# EAGLE design PoE (EAGLE 4.16)
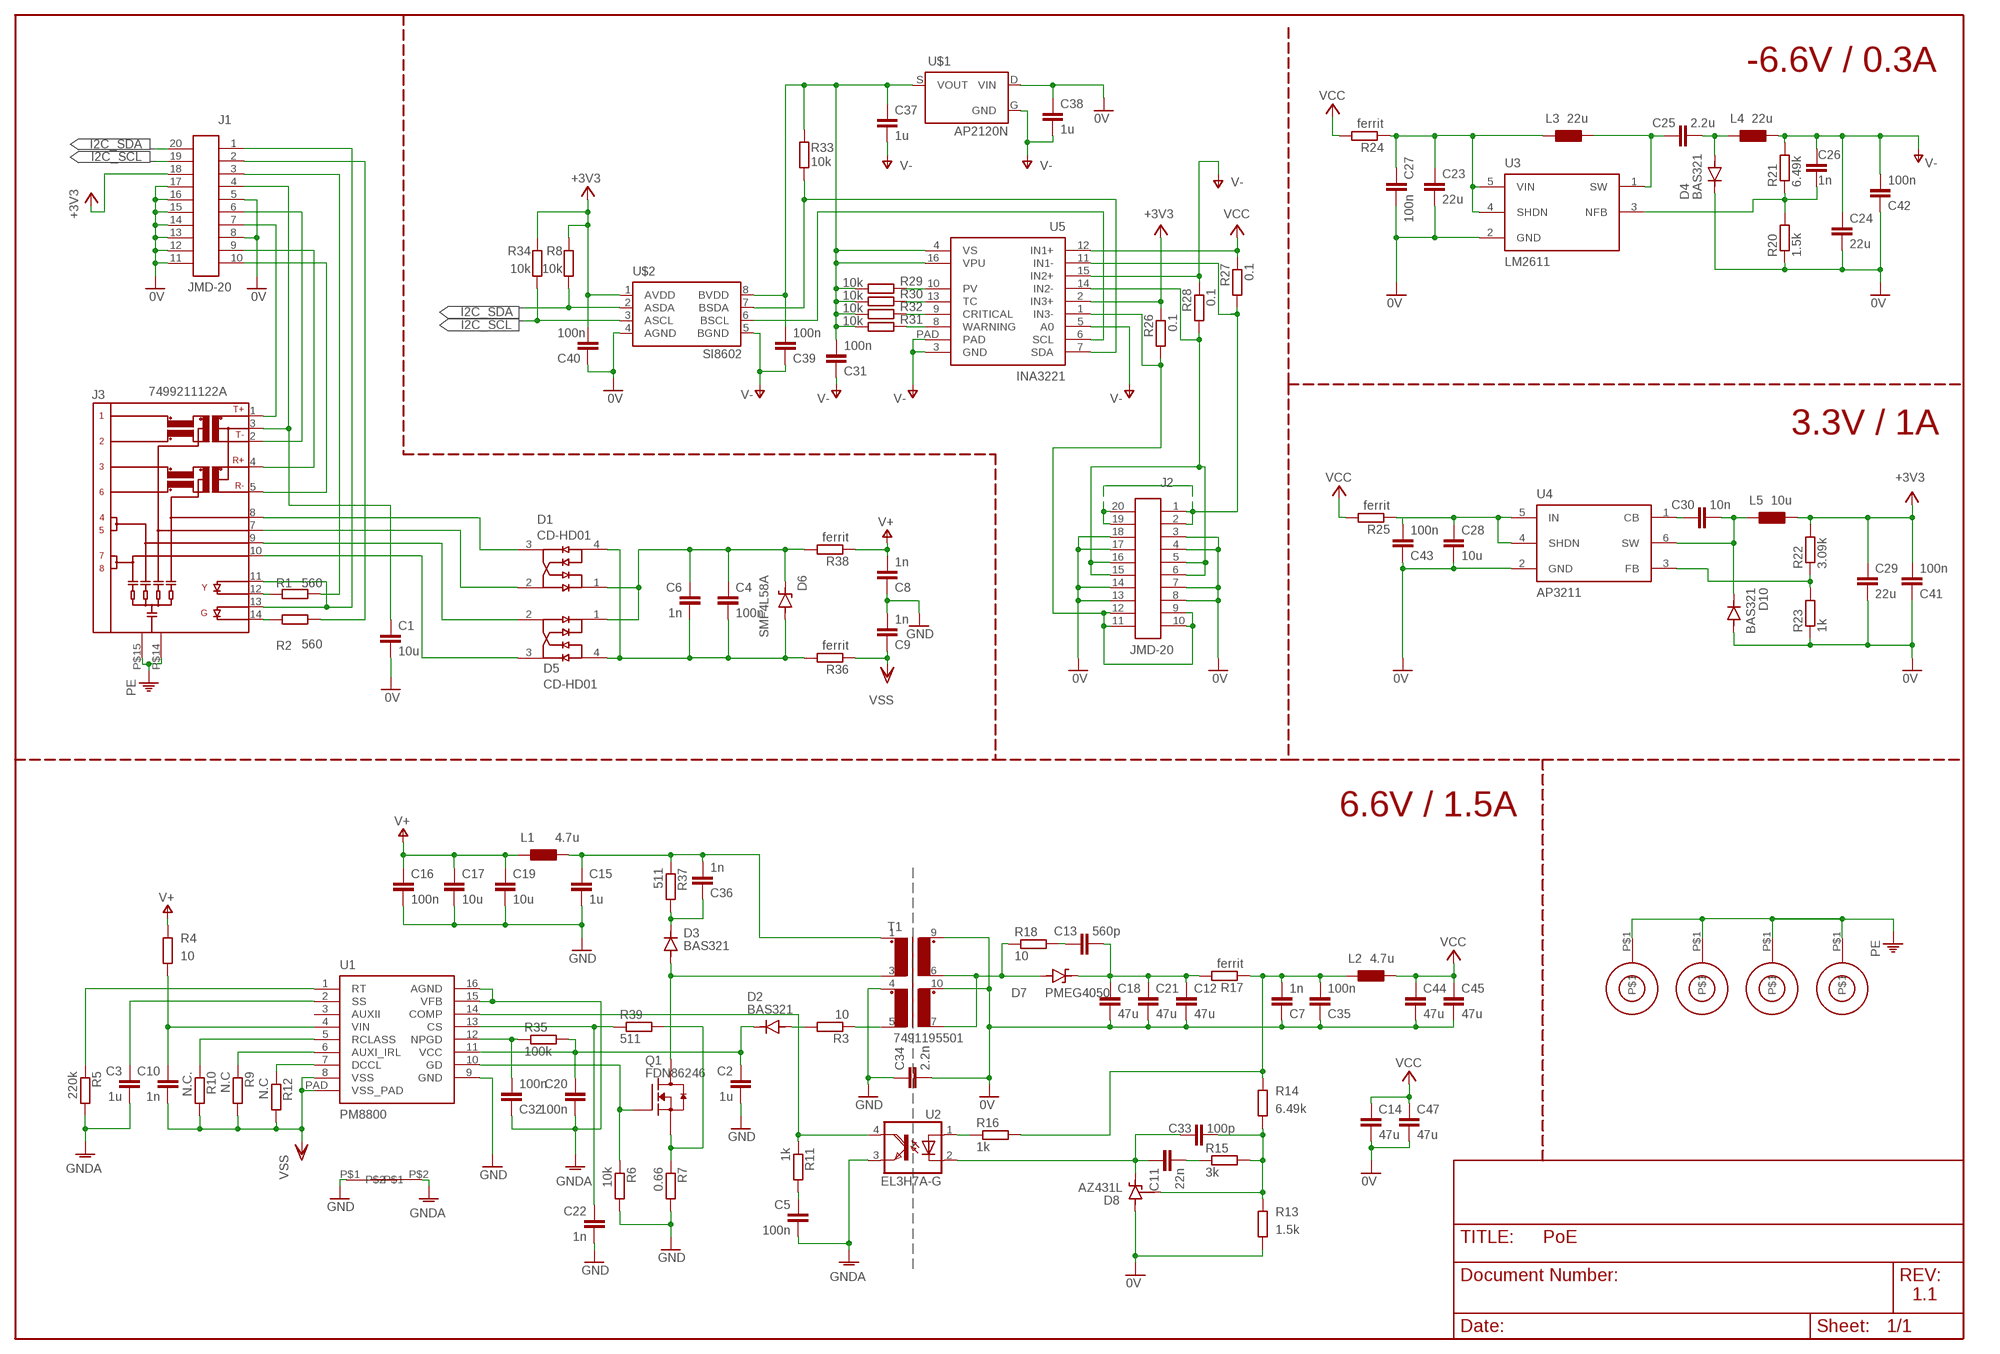
[diagram p0: schematic, sheet 1]

## Parts
C1  10u  C-EUC0603K  [C0603K]
C2  1u  C-EUC0603K  [C0603K]
C3  1u  C-EUC0603K  [C0603K]
C4  100n  C-EUC1206  [C1206]
C5  100n  C-EUC0603K  [C0603K]
C6  1n  C-EUC0603K  [C0603K]
C7  1n  C-EUC0603K  [C0603K]
C8  1n  C-EUC0603K  [C0603K]
C9  1n  C-EUC0603K  [C0603K]
C10  1n  C-EUC0603K  [C0603K]
C11  22n  C-EUC0603K  [C0603K]
C12  47u  C-EUC1206  [C1206]
C13  560p  C-EUC0603K  [C0603K]
C14  47u  C-EUC1206  [C1206]
C15  1u  C-EUC1206  [C1206]
C16  100n  C-EUC1206  [C1206]
C17  10u  C-EUC2220K  [C2220K]
C18  47u  C-EUC1206  [C1206]
C19  10u  C-EUC2220K  [C2220K]
C20  100n  C-EUC0603K  [C0603K]
C21  47u  C-EUC1206  [C1206]
C22  1n  C-EUC0603K  [C0603K]
C23  22u  C-EUC1206  [C1206]
C24  22u  C-EUC1206  [C1206]
C25  2.2u  C-EUC0603K  [C0603K]
C26  1n  C-EUC0603K  [C0603K]
C27  100n  C-EUC0603K  [C0603K]
C28  10u  C-EUC1206  [C1206]
C29  22u  C-EUC1206  [C1206]
C30  10n  C-EUC0603K  [C0603K]
C31  100n  C-EUC0603K  [C0603K]
C32  100n  C-EUC0603K  [C0603K]
C33  100p  C-EUC0603K  [C0603K]
C34  2.2n  C-EUC1206  [C1206]
C35  100n  C-EUC0603K  [C0603K]
C36  1n  C-EUC0603K  [C0603K]
C37  1u  C-EUC0603K  [C0603K]
C38  1u  C-EUC0603K  [C0603K]
C39  100n  C-EUC0603K  [C0603K]
C40  100n  C-EUC0603K  [C0603K]
C41  100n  C-EUC0603K  [C0603K]
C42  100n  C-EUC0603K  [C0603K]
C43  100n  C-EUC0603K  [C0603K]
C44  47u  C-EUC1206  [C1206]
C45  47u  C-EUC1206  [C1206]
C47  47u  C-EUC1206  [C1206]
D1  CD-HD01  [RECT]
D2  BAS321  [SOD323_R]
D3  BAS321  [SOD323_R]
D4  BAS321  [SOD323_R]
D5  CD-HD01  [RECT]
D6  SMF4L58A  [SOD123FL]
D7  PMEG4050  [SOD128]
D8  AZ431L  [SSOT-3]
D10  BAS321  [SOD323_R]
J1  JMD-20  [CON]
J2  JMD-20  [CON]
J3  7499211122A  [ETH2]
L1  4.7u  VLS252010HBX  [2520]
L2  4.7u  VLS252010HBX  [2520]
L3  22u  VLS252010HBX  [2520]
L4  22u  VLS252010HBX  [2520]
L5  10u  VLS252010HBX  [2520]
Q1  FDN86246  [SSOT-3]
R1  560  R-EU_R0603  [R0603]
R2  560  R-EU_R0603  [R0603]
R3  10  R-EU_R0603  [R0603]
R4  10  R-EU_R0603  [R0603]
R5  220k  R-EU_R0603  [R0603]
R6  10k  R-EU_R0603  [R0603]
R7  0.66  R-EU_R0603  [R0603]
R8  10k  R-EU_R0603  [R0603]
R9  N.C  R-EU_R0603  [R0603]
R10  N.C.  R-EU_R0603  [R0603]
R11  1k  R-EU_R0603  [R0603]
R12  N.C  R-EU_R0603  [R0603]
R13  1.5k  R-EU_R0603  [R0603]
R14  6.49k  R-EU_R0603  [R0603]
R15  3k  R-EU_R0603  [R0603]
R16  1k  R-EU_R0603  [R0603]
R17  ferrit  R-EU_R0603  [R0603]
R18  10  R-EU_R0603  [R0603]
R19  EMPTY  [EMPTY]
R20  1.5k  R-EU_R0603  [R0603]
R21  6.49k  R-EU_R0603  [R0603]
R22  3.09k  R-EU_R0603  [R0603]
R23  1k  R-EU_R0603  [R0603]
R24  ferrit  R-EU_R0603  [R0603]
R25  ferrit  R-EU_R0603  [R0603]
R26  0.1  R-EU_R0603  [R0603]
R27  0.1  R-EU_R0603  [R0603]
R28  0.1  R-EU_R0603  [R0603]
R29  10k  R-EU_R0603  [R0603]
R30  10k  R-EU_R0603  [R0603]
R31  10k  R-EU_R0603  [R0603]
R32  10k  R-EU_R0603  [R0603]
R33  10k  R-EU_R0603  [R0603]
R34  10k  R-EU_R0603  [R0603]
R35  100k  R-EU_R0603  [R0603]
R36  ferrit  R-EU_R0603  [R0603]
R37  511  R-EU_R0603  [R0603]
R38  ferrit  R-EU_R0603  [R0603]
R39  511  R-EU_R0603  [R0603]
T1  7491195501  [POE]
U1  PM8800  [PM8800]
U2  EL3H7A-G  [OPTO]
U3  LM2611  [SOT-23-5]
U4  AP3211  [SOT-23-6]
U5  INA3221  [INA3221]
U$1  AP2120N  [SSOT-3]
U$2  SI8602  [SO8]
U$3  MOUNT  [MOUNT]
U$4  MOUNT  [MOUNT]
U$7  MOUNT  [MOUNT]
U$11  MOUNT  [MOUNT]

## Nets
0V: C1.2 C7.1 C12.2 C14.2 C18.2 C21.2 C23.2 C24.2 C27.2 C28.2 C29.2 C34.2 C35.1 C38.1 C40.1 C41.1 C42.1 C43.1 C44.2 C45.2 C47.2 D4.C(K) D8.D(A) D10.A J1.5 J1.8 J1.11 J1.12 J1.13 J1.14 J1.15 J1.16 J1.17 J2.3 J2.4 J2.7 J2.8 J2.13 J2.14 J2.17 J2.18 R13.1 R20.1 R23.1 T1.9 T1.10 U3.2(GND) U4.2(GND) U$1.D(VIN) U$2.4(AGND)
+3V3: C29.1 C40.2 C41.2 J1.18 L5.P$2 R8.2 R22.2 R26.1 R34.2 U5.2(IN3+) U$2.1(AVDD)
GND: C2.2 C8.1 C9.2 C15.2 C16.2 C17.2 C19.2 C22.2 C34.1 R6.2 R7.2 R19.P$1 T1.4 U1.9(GND)
GNDA: C3.2 C5.2 C20.2 C32.1 R5.2 R19.P$2 U1.15(VFB) U1.16(AGND) U2.3
I2C_SCL: J1.19 R34.1 U$2.3(ASCL)
I2C_SCL2: U5.6(SCL) U$2.6(BSCL)
I2C_SDA: J1.20 R8.1 U$2.2(ASDA)
I2C_SDA2: R33.2 U5.7(SDA) U$2.7(BSDA)
N$1: D7.2 R18.1 T1.6 T1.7
N$2: C11.1 C33.1 D8.S(K) U2.2
N$3: C13.1 R18.2
N$4: J1.6 J3.2
N$5: J1.9 J3.4
N$6: J1.10 J3.5
N$7: D1.3 J3.8
N$8: D1.2 J3.7
N$9: J1.1 J3.11 J3.13
N$10: D5.3 J3.10
N$11: D5.2 J3.9
N$12: J1.3 R1.2
N$13: J1.2 R2.2
N$14: J3.14 R2.1
N$15: J3.12 R1.1
N$16: C3.1 U1.2(SS)
N$17: C1.1 J1.4 J3.3
N$18: C2.1 C20.1 D2.C(K) R35.2 U1.11(VCC)
N$19: D2.A R3.2
N$20: R3.1 T1.5
N$21: C10.1 R4.2 U1.4(VIN)
N$22: R5.1 U1.1(RT)
N$23: D3.A Q1.D T1.3
N$24: Q1.G R6.1 U1.10(GD)
N$25: Q1.S R7.1 R39.2
N$26: C4.2 C6.2 D1.4 D5.4 D6.2 R36.2
N$27: R9.1 U1.6(AUXI_IRL)
N$28: C31.2 C37.1 C39.2 R29.1 R30.1 R31.1 R32.1 R33.1 U5.4(VS) U5.16(VPU) U$1.S(VOUT) U$2.8(BVDD)
N$29: R10.1 U1.5(RCLASS)
N$30: R12.1 U1.7(DCCL)
N$31: R11.1 U1.14(COMP) U2.4
N$32: J1.7 J3.1
N$33: C5.1 R11.2
N$34: C36.1 D3.C(K) R37.2
N$35: R16.1 U2.1
N$36: C11.2 R15.1
N$37: C33.2 D8.G(R) R13.2 R14.2 R15.2
N$38: C15.1 C36.2 L1.P$2 R37.1 T1.1
N$39: C7.2 C35.2 L2.P$1 R14.1 R16.2 R17.1
N$43: C22.1 R39.1 U1.13(CS)
N$47: C23.1 C27.1 L3.P$1 R24.1 U3.4(SHDN) U3.5(VIN)
N$48: C28.1 C43.2 R25.1 U4.4(SHDN) U4.5(IN)
N$49: C32.2 R35.1 U1.12(NPGD)
N$50: C25.1 L3.P$2 U3.1(SW)
N$51: C25.2 D4.A L4.P$1
N$53: C30.1 U4.1(CB)
N$54: C26.2 R20.2 R21.1 U3.3(NFB)
N$55: C30.2 D10.C(K) L5.P$1 U4.6(SW)
N$56: R22.1 R23.2 U4.3(FB)
N$57: J2.9 J2.10 J2.11 J2.12 R26.2 U5.1(IN3-)
N$59: R29.2 U5.10(PV)
N$60: J2.5 J2.6 J2.15 J2.16 R28.2 U5.14(IN2-)
N$61: R30.2 U5.13(TC)
N$62: R32.2 U5.9(CRITICAL)
N$63: R31.2 U5.8(WARNING)
N$68: C12.1 C13.2 C18.1 C21.1 D7.1 R17.2
N$69: C4.1 C6.1 D1.1 D5.1 D6.1 R38.2
N$70: J2.1 J2.2 J2.19 J2.20 R27.2 U5.11(IN1-)
PE: J3.P$14 J3.P$15 U$3.P$1 U$4.P$1 U$7.P$1 U$11.P$1
V+: C8.2 C16.1 C17.1 C19.1 L1.P$1 R4.1 R38.1
V-: C24.1 C26.1 C31.1 C37.2 C38.2 C39.1 C42.2 L4.P$2 R21.2 R28.1 U5.3(GND) U5.5(A0) U5.15(IN2+) U5.PAD U$1.G(GND) U$2.5(BGND)
VCC: C14.1 C44.1 C45.1 C47.1 L2.P$2 R24.2 R25.2 R27.1 U5.12(IN1+)
VSS: C9.1 C10.2 R9.2 R10.2 R12.2 R36.1 U1.8(VSS) U1.PAD(VSS_PAD)
Unconnected: U1.3(AUXII)

## Notes on the sheet
- -6.6V / 0.3A
- 3.3V / 1A
- 6.6V / 1.5A
- 1.1

## Library data of the parts
C1-C45 C47 = rcl:C-EU: CAPACITOR, European symbol
D1 D5 = trafo_mod:CD-HD01
D2-D4 D10 = trafo_mod:BAS321
D6 = trafo_mod:SMF4L58A
D7 = trafo_mod:PMEG4050
D8 = trafo_mod:AZ431L
J1 J2 = trafo_mod:JMD-20
J3 = trafo_mod:7499211122A
L1-L5 = trafo_mod:VLS252010HBX
Q1 = trafo_mod:FDN86246
R1-R18 R20-R39 = rcl:R-EU_: RESISTOR, European symbol
R19 = trafo_mod:EMPTY
T1 = trafo_mod:7491195501
U1 = trafo_mod:PM8800
U2 = trafo_mod:EL3H7A-G
U3 = trafo_mod:LM2611
U4 = trafo_mod:AP3211
U5 = trafo_mod:INA3221
U$1 = trafo_mod:AP2120N
U$2 = trafo_mod:SI8602
U$3 U$4 U$7 U$11 = trafo_mod:MOUNT

## Board
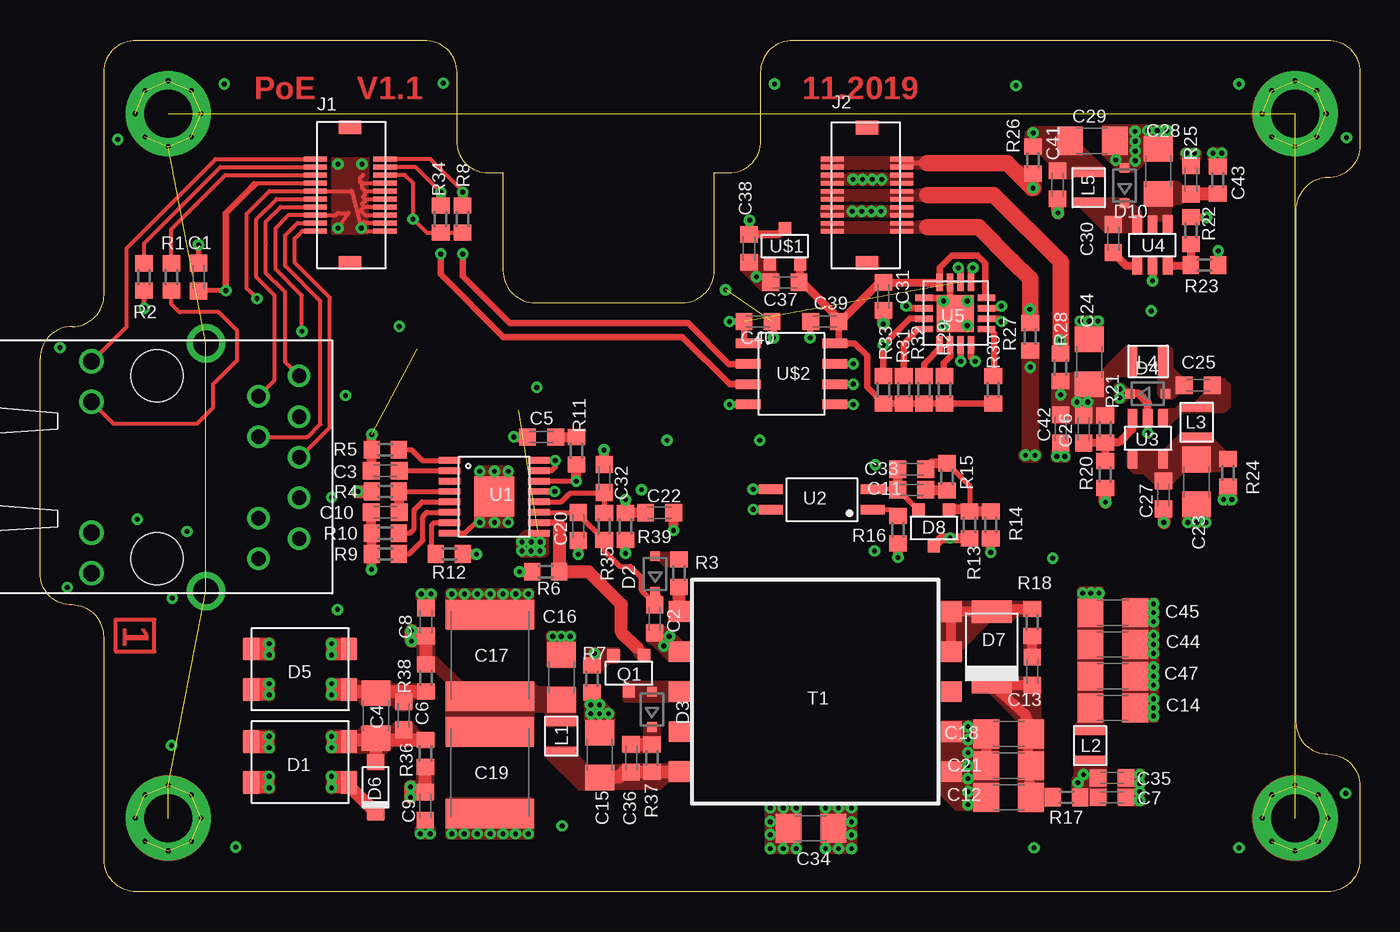
[diagram p1: board, top side]
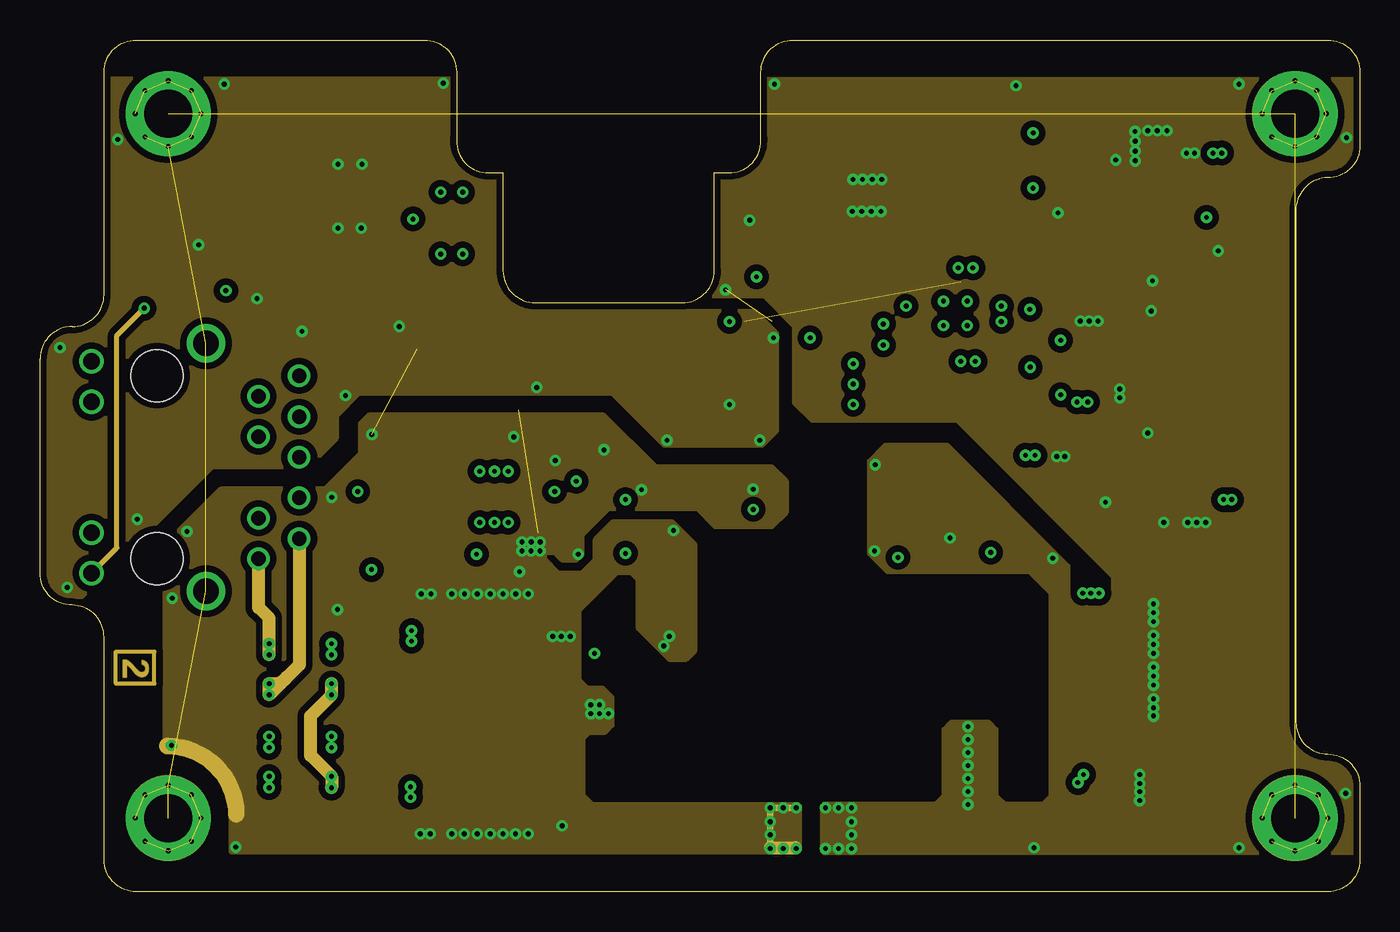
[diagram p2: board, inner layer Route2]
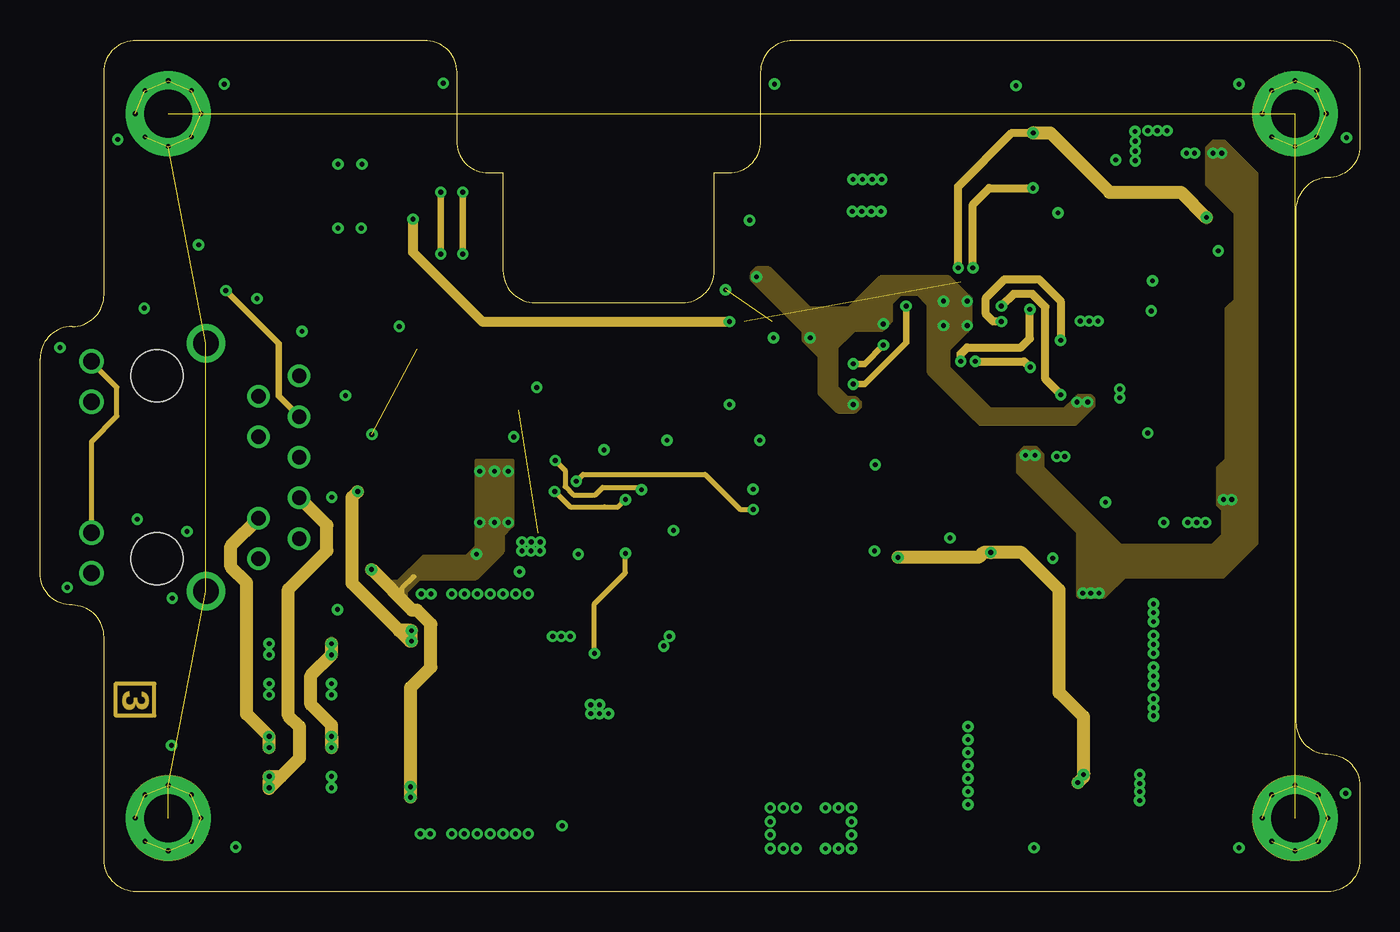
[diagram p3: board, inner layer Route15]
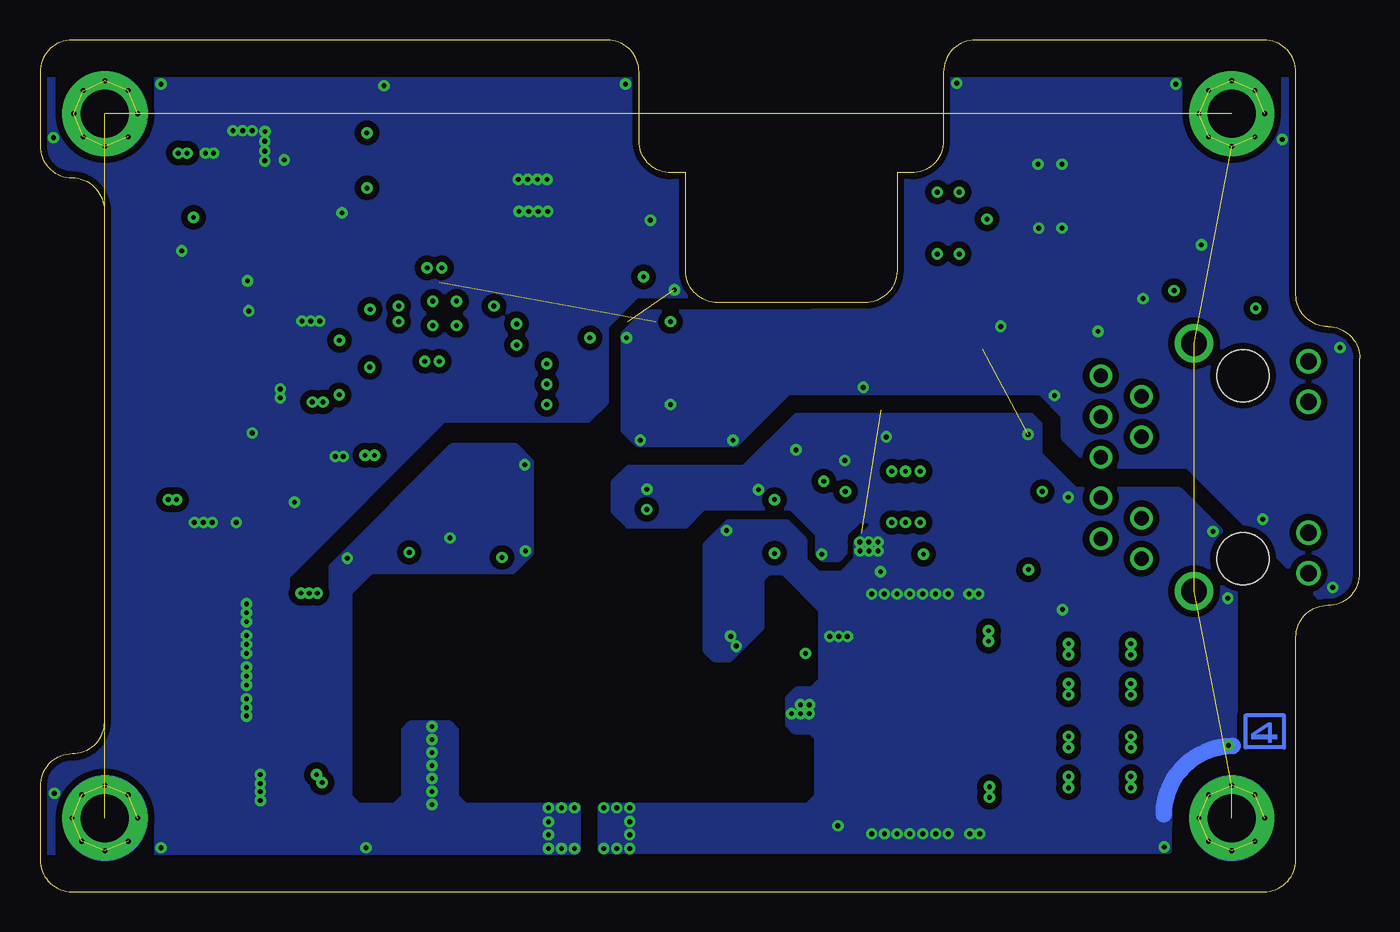
[diagram p4: board, bottom side, seen from below]

Size 82.4 x 53.2 mm. Coordinates in mm from the lower left corner, seen from the top.
Outline: 24,53.2 arc-90 26,51.2
Outline: 26,51.2 26,47.1
Outline: 45,47.1 45,51.2
Outline: 45,51.2 arc-90 47,53.2
Outline: 47,53.2 80.4,53.2 arc-90 82.4,51.2 82.4,46.6 arc-90 80.4,44.6 arc90 78.4,42.55 78.4,10.6 arc90 80.4,8.6 arc-90 82.4,6.6 82.4,2 arc-90 80.4,0 6,0 arc-90 4,2 4,15.9 arc90 2,17.9 arc-90 0,19.9 0,33.3 arc-90 2,35.3 arc90 4,37.3 4,51.2 arc-90 6,53.2 24,53.2
Outline: 24,53.2 arc-90 26,51.2
Outline: 26,51.2 26,46.9 arc90 28,44.9 28.9,44.9 28.9,38.8 arc90 30.9,36.8 40.1,36.8 arc90 42.1,38.8 42.1,44.9 43,44.9 arc90 45,46.9 45,51.2
Outline: 45,51.2 arc-90 47,53.2
Copper layers (1+2*15+16): Top 0.035mm / dielectric 0.1mm / Route2 0.035mm / dielectric 1.3mm / Route15 0.035mm / dielectric 0.1mm / Bottom 0.035mm
Design rules "default": minimum track width 10mil, minimum drill 0.3mm, track to track 10mil, track to pad 10mil, pad to pad 10mil, via to via 10mil, smd to smd 5mil, copper to edge 12mil, drill to drill 8mil, minimum pad ring 10mil, minimum via ring 8mil, stop-mask expansion 4mil, vias tented up to drill 20mil, thermal gap 12mil
bRestrict: area 75.7,2.1 to 77,4.6; area 75.7,48.6 to 77.1,51.1; area 9.3,48.6 to 10.7,51.4; area 5.3,48.6 to 6.7,51.4; area 79.6,48.6 to 81,51.1; area 79.7,2.1 to 81,4.6

### Footprints (pad centres in the part's own frame; a part is rotated, then mirrored left to right if it is on the bottom)
C0603K = smd 1.05 x 1.08: 1 -0.875,0; 2 0.875,0
C1206 = smd 1.6 x 1.8: 1 -1.4,0; 2 1.4,0
C2220K = smd 1.85 x 5.5: 1 -2.55,0; 2 2.55,0
RECT = smd 1.397 x 0.991: 1 1.27,2.286; 2 1.27,-3.81; 3 -1.27,-3.81; 4 -1.27,2.286
SOD323_R = smd 0.6 x 0.6: A 1.1,0; C -1.1,0
SOD123FL = smd 0.95 x 1.05: 1 -2.1,1.15; 2 1.05,1.15
SOD128 = smd 1.4 x 2.5: 1 -2.1,0.2; 2 2.3,0.2
SSOT-3 = smd 0.762 x 0.762: D 0,2.286; G -0.953,0; S 0.953,0
CON = smd 0.3 x 1.45: 1 -3,0.5; 2 -2.5,0.5; 3 -2,0.5; 4 -1.5,0.5; 5 -1,0.5; 6 -0.5,0.5; 7 0,0.5; 8 0.5,0.5; 9 1,0.5; 10 1.5,0.5; 11 1.5,4.85; 12 1,4.85; 13 0.5,4.85; 14 0,4.85; 15 -0.5,4.85; 16 -1,4.85; 17 -1.5,4.85; 18 -2,4.85; 19 -2.5,4.85; 20 -3,4.85 | smd 0.85 x 1.4: P$1 -4.975,2.675; P$2 3.475,2.675
ETH2 = drill 0.9 pad 1.3 round: 1 6.12,-8.68; 2 4.85,-6.14; 3 3.58,-8.68; 4 2.31,-6.14; 5 1.04,-8.68; 7 -1.5,-8.68; 8 -2.77,-6.14; 9 -4.04,-8.68; 10 -5.31,-6.14 | drill 1.02 pad 1.5 round: 11 7.04,4.28; 12 4.5,4.28; 13 -3.67,4.28; 14 -6.2,4.28 | drill 1.6 pad 2.2 round: P$14 -7.33,-2.85; P$15 8.16,-2.85 | hole 3.25: -5.3,0.2; 6.13,0.2
2520 = smd 0.6 x 2: P$1 -0.95,0; P$2 0.95,0
R0603 = smd 1 x 1.1: 1 -0.85,0; 2 0.85,0
EMPTY = smd 0 x 0: P$1 -3.81,2.54; P$2 2.54,-1.27
POE = smd 1.3 x 1.3: 1 5,0; 2 2.5,0; 3 0,0; 4 -2.5,0; 5 -5,0; 6 -5,17; 7 -2.5,17; 8 0,17; 9 2.5,17; 10 5,17
PM8800 = smd 1.35 x 0.4: 1 -1.95,4.55; 2 -1.95,3.9; 3 -1.95,3.25; 4 -1.95,2.6; 5 -1.95,1.95; 6 -1.95,1.3; 7 -1.95,0.65; 8 -1.95,0; 9 3.65,0; 10 3.65,0.65; 11 3.65,1.3; 12 3.65,1.95; 13 3.65,2.6; 14 3.65,3.25; 15 3.65,3.9; 16 3.65,4.55 | smd 2.5 x 2.5: PAD 0.85,2.275
OPTO = smd 1.5 x 0.6: 1 -2.94,0.47; 2 -2.94,-0.8; 3 3.41,-0.8; 4 3.41,0.47
SOT-23-5 = smd 0.6 x 1.1: 1 -1,-1.3; 2 -0.05,-1.3; 3 0.9,-1.3; 4 0.9,1.3; 5 -1,1.3
SOT-23-6 = smd 0.6 x 1.1: 1 -1,-1.3; 2 -0.05,-1.3; 3 0.9,-1.3; 4 0.9,1.3; 5 -0.05,1.29; 6 -1,1.3
INA3221 = smd 0.4 x 1.1: 1 -1.3,-2.095; 2 -0.65,-2.095; 3 0,-2.095; 4 0.65,-2.095; 9 0.65,1.805; 10 0,1.805; 11 -0.65,1.805; 12 -1.3,1.805 | smd 1.1 x 0.4: 5 1.625,-1.12; 6 1.625,-0.47; 7 1.625,0.18; 8 1.625,0.83; 13 -2.275,0.83; 14 -2.275,0.18; 15 -2.275,-0.47; 16 -2.275,-1.12 | smd 2.3 x 2.3: PAD -0.325,-0.145
SO8 = smd 1.55 x 0.6: 1 -2.54,1.27; 2 -2.54,0; 3 -2.54,-1.27; 4 -2.54,-2.54; 5 2.857,-2.54; 6 2.857,-1.27; 7 2.857,0; 8 2.857,1.27
MOUNT = drill 3 pad 5.3 round: P$1 0,0

### Placement (x,y rotation side)
C1  9.9,38.4 90 top
C2  38.37,17.04 270 top
C3  21.55,26.3 180 top
C4  20.97,11 270 top
C5  31.31,28.4 180 top
C6  22.7,11 270 top
C7  66.92,5.9 180 top
C8  24.1,16.85 270 top
C9  24.05,5.35 270 top
C10  21.55,23.7 180 top
C11  54.43,25.1 0 top
C12  60.47,5.9 180 top
C13  61.94,13.77 270 top
C14  66.97,11.49 0 top
C15  34.95,8.54 90 top
C16  32.55,13.4 90 top
C17  28.09,14.76 90 top
C18  60.47,9.86 180 top
C19  28.08,7.44 270 top
C20  33.6,22.82 270 top
C21  60.47,7.88 180 top
C22  38.68,23.68 0 top
C23  72.2,25.6 270 top
C24  65.5,33.1 90 top
C25  72.3,31.63 180 top
C26  65.16,28.9 270 top
C27  70.13,24.79 270 top
C28  69.81,45 90 top
C29  65.7,46.9 0 top
C30  67,40.8 90 top
C31  52.65,37.19 90 top
C32  35.22,25.81 270 top
C33  54.43,26.39 0 top
C34  48.13,3.97 0 top
C35  66.92,7.12 180 top
C36  36.9,8.35 270 top
C37  46.5,38.06 180 top
C38  44.27,40.19 270 top
C39  48.99,35.62 0 top
C40  44.82,35.62 180 top
C41  63.52,44.15 90 top
C42  63.72,28.91 90 top
C43  71.85,44.46 270 top
C44  66.97,15.45 0 top
C45  66.97,17.43 0 top
C47  66.97,13.47 0 top
D1  17,8.1 270 top
D2  38.4,19.85 90 top
D3  38.2,11.4 90 top
D4  69.15,31.1 0 top
D5  17,13.9 270 top
D6  22.1,7.05 90 top
D7  59.61,15.2 90 top
D8  55.79,23.87 180 top
D10  67.71,44.1 90 top
J1  16.69,42.76 270 top
J2  54.3,44.25 90 top
J3  7.5,26.1 90 top
L1  32.55,9.7 270 top
L2  65.55,9.15 90 top
L3  72.2,29.34 90 top
L4  69.15,33.12 180 top
L5  65.47,44 90 top
Q1  36.75,14.8 180 top
R1  8.2,38.4 90 top
R2  6.5,38.4 90 top
R3  39.9,19.9 90 top
R4  21.55,25 0 top
R5  21.55,27.6 180 top
R6  31.56,19.99 180 top
R7  34.45,13.29 270 top
R8  26.38,42.02 270 top
R9  21.55,21.1 180 top
R10  21.55,22.4 180 top
R11  33.5,27.54 90 top
R12  25.55,21.1 0 top
R13  58.03,22.92 90 top
R14  59.35,22.92 90 top
R15  56.61,25.91 90 top
R16  53.56,22.61 270 top
R17  64.08,5.9 180 top
R18  61.94,16.82 270 top
R19  26.08,32.62 180 top
R20  66.5,26.06 90 top
R21  66.5,28.9 90 top
R22  71.86,41.29 90 top
R23  72.7,39.14 180 top
R24  74.15,26.17 270 top
R25  73.52,44.44 90 top
R26  61.99,45.69 270 top
R27  61.82,34.67 90 top
R28  63.71,32.75 90 top
R29  56.46,31.35 90 top
R30  59.51,31.35 90 top
R31  53.92,31.35 90 top
R32  55.19,31.35 90 top
R33  52.65,31.35 90 top
R34  25.01,42.02 270 top
R35  35.22,22.82 270 top
R36  24.06,8.65 90 top
R37  38.2,8.35 90 top
R38  24.09,13.35 270 top
R39  36.54,22.82 270 top
T1  39.9,12.5 270 top
U1  27.5,22.4 0 top
U2  49.04,24.34 180 top
U3  69.1,28.3 180 top
U4  69.5,40.4 0 top
U5  56.81,35.97 180 top
U$1  46.5,39.17 0 top
U$2  46.75,32.98 0 top
U$3  78.35,48.6 0 top
U$4  78.35,4.6 0 top
U$7  8,48.6 0 top
U$11  8,4.6 0 top

### Tracks (layer width: path | path; a pad name or v marks a point on that pad's centre or on a via)
0V  (via drill 0.3)  (1 unrouted)
  Top 0.254: J1.12 20.29,41.76 | J1.14 | J1.14 | 21.54,43.24 J1.15 20.29,43.26 | J1.16 | J1.16 | 15.45,42.2 15.51,42.26 J1.8 18.46,42.26 18.6,42.4 19.25,42.4 v18.6,41.45 | 14.2,43.65 14.31,43.76 J1.5 19.44,43.76 19.45,43.75 v20.05,41.45 | 20.16,44.76 20,44.6 20,44.3 20.1,44.2 | J1.17 20.16,44.26 20.1,44.2 | 20.1,44.2 20.1,43.95 20.29,43.76 | 20.29,43.76 J1.16 | 20.29,43.76 20.29,43.54 20.15,43.4 20.29,43.26 | 20.29,43.26 20.29,43.14 20.1,42.95 20.29,42.76 | J1.14 20.29,42.76 | 20.29,41.76 20.2,41.85 | 20.29,41.76 20.29,41.69 20.1,41.5 20.34,41.26 J1.11 | 20.29,42.76 20.21,42.76 20,42.55 20.29,42.26 J1.13 | 56.76,22.1 56.77,22.1 v56.81,22.1
  Top 0.305: 9.9,39.22 9.9,39.1 | C1.2 9.9,39.22 | 9.9,39.22 v9.9,40.4 | C42.1 63.72,27.44 v63.98,27.18
  Top 0.406: C40.1 45.79,35.53 v45.79,34.6 | 44.27,30.44 U$2.4 v43.05,30.44
  Top 0.508: 69.45,39.15 69.4,39.2 | U4.2 69.45,39.15 | 69.45,39.15 v69.45,38.15 | 69.45,39.15 | R23.1 73.5,39.1 | R23.1 | v73.55,40.03 R23.1 | v69.15,28.66 69.2,28.71 v69.15,28.66 U3.2 | D4.C 68.59,31.1 69.16,30.54 U3.2 | U3.2 69.16,29.37 | U$1.D 46.11,41.06 C38.1 | C38.1 44.22,41 | v44.3,41.94 44.3,41.09 C38.1
  Top 0.61: 55.86,21.59 55.85,21.6 55.84,21.59 D8.D 56.3,22.1 56.76,22.1 57.98,22.1 58.02,22.07 R13.1 | 59.1,7.85 59.1,7.78 | C21.2 59.1,7.85 | 59.1,7.85 59.1,9.83 C18.2 59.1,9.86
  Top 0.813: R20.1 66.47,25.21 66.47,25.2 66.51,25.16 v66.51,24.33 | C27.2 70.13,23.89 70.12,23.88 70.15,23.85 v70.15,23.06 | 63.52,43.34 63.47,43.34 | 63.52,43.34 C41.1 | v63.55,42.41 63.55,43.34 63.52,43.34
  other vias: 70.35,47.54 69.16,47.54 68.36,47.49 68.37,46.88 69.75,47.54 66.05,35.65 72.76,23.07 64.95,35.65 67.41,31.4 67.41,30.85 71.65,23.07 50.75,44.5 52.55,44.5 52.5,42.5 50.7,42.5 51.35,44.5 51.95,44.5 51.3,42.5 51.9,42.5 68.65,5.69 68.65,6.76 16.35,35 13.55,37.05 20.1,45.45 18.6,45.45 57.93,9.5 57.93,8.69 57.93,7.07 57.93,6.25 57.93,7.88 49.04,2.7 49.85,2.7 50.66,2.7 49.04,5.24 49.85,5.24 50.66,5.24 50.66,4.37 50.66,3.56 57.93,5.44 57.93,10.32 69.52,14.02 69.52,12.04 68.65,6.25 69.52,10.98 69.52,11.48 69.52,12.91 69.52,13.47 65.49,35.65 72.21,23.07 68.37,46.27 67.16,45.71 68.37,45.66 63.47,27.18 71.57,46.13 72.08,46.13 68.65,7.32 69.52,14.89 69.52,15.45 69.52,16.01 69.52,16.87 69.52,17.43 69.52,17.99 74.85,2.75 81.51,6.15 81.56,47.1 74.85,50.45 45.85,50.45 42.8,37.6 69.37,36.28 39.14,28.2 44.93,28.2 19.07,30.99 6.07,23.27 1.7,19 1.24,33.99 4.85,46.99 11.5,50.45 22.43,35.31 31.01,31.5 25.17,50.5 52.14,26.67 52.09,21.29 63.22,20.83 60.93,50.35 62.05,2.75
  pour Top (no thermals): 48.85,42.25 48.85,42.75 54.4,42.75 54.4,42.25
  pour Top (no thermals): 48.85,44.75 48.85,44.25 54.4,44.25 54.4,44.75
  pour Top (isolate 0.254): 17.8,41.15 17.8,45.75 20.95,45.75 20.95,41.15
  pour Top (no thermals): 49.09,2.55 50.56,2.55 50.82,2.8 50.82,5.09 50.51,5.39 49.19,5.39 48.89,5.09 48.89,2.8 49.14,2.55
  pour Top (no thermals): 56.41,10.52 59.25,10.52 59.66,10.12 59.66,5.34 59.56,5.24 57.22,5.24 56.41,6.05
  pour Top (no thermals): 67.84,31.25 67.53,31.55 67.28,31.55 67.28,30.74 67.48,30.74 67.58,30.74 67.94,31.1 67.94,31.15
  pour Top (no thermals): 64.74,35.21 64.74,35.77 64.84,35.87 66.16,35.87 66.26,35.77 66.26,35.26 66.21,35.21
  pour Top (no thermals): 71.44,23.48 71.44,22.97 71.55,22.87 72.87,22.87 72.97,22.97 72.97,23.48 72.92,23.53 71.49,23.53
  pour Top (no thermals): 66.47,46.08 67.48,45.07 68.34,45.07 69.26,45.98 69.56,45.98 70.53,46.95 70.53,47.1 70.58,47.15 70.58,47.61 70.43,47.76 66.41,47.76 66.41,46.13
  pour Top (no thermals): 63.26,27.49 63.26,27.03 63.32,26.98 64.18,26.98 64.18,27.49
  pour Top (no thermals): 71.34,45.78 71.34,46.23 71.44,46.34 72.21,46.34 72.36,46.18 72.36,45.83 72.21,45.68 71.44,45.68
  pour Route2 (isolate 0.406): 51.73,21.14 52.9,19.97 61.74,19.97 63.06,18.65 63.06,5.95 62.6,5.49 48.94,5.49 48.79,5.34 48.79,2.55 48.89,2.44 88.31,2.44 88.36,50.76 42.94,50.76 39.39,47.2 39.39,38.97 41.17,37.19 45.18,37.19 47.06,35.31 47.06,30.54 48.18,29.42 57.22,29.42 66.97,19.67 66.97,18.65 64.23,18.65 64.23,20.33 56.66,27.9 52.75,27.9 51.73,26.88
  pour Bottom (isolate 0.406): 51.73,21.14 52.9,19.97 61.74,19.97 63.06,18.65 63.06,5.95 62.45,5.34 48.79,5.34 48.79,2.6 48.94,2.44 94.05,2.44 92.58,50.76 42.94,50.76 39.39,47.2 39.39,38.97 41.17,37.19 45.18,37.19 47.06,35.31 47.06,30.54 48.18,29.42 57.22,29.42 66.97,19.67 66.97,18.65 64.23,18.65 64.23,20.33 56.66,27.9 52.75,27.9 51.73,26.88
  pour Bottom (isolate 0.406): 0.43,16.26 10.74,26.57 16.73,26.57 18.51,28.35 18.51,29.72 19.93,31.15 35.73,31.15 38.98,27.9 45.08,27.9 45.99,28.81 45.99,34.86 44.62,36.23 34.21,36.23 31.36,39.07 31.36,48.01 28.72,50.76 1.34,50.76 -5.62,27.9
  pour Route2 (isolate 0.406): 0.53,16.36 10.74,26.57 16.73,26.57 18.51,28.35 18.51,29.72 19.93,31.15 35.73,31.15 38.98,27.9 45.08,27.9 45.99,28.81 45.99,34.86 44.62,36.23 34.21,36.23 31.36,39.07 31.36,48.01 28.72,50.76 1.34,50.76 -5.47,28
  pour Top (isolate 0.406, no thermals): 67.38,7.52 67.38,5.49 68.85,5.49 68.85,7.52
  pour Top (isolate 0.406, no thermals): 67.68,10.73 69.72,10.73 69.72,18.19 67.68,18.19
  pour Route2 (isolate 0.406, no thermals): 59.56,4.58 60.37,5.29 59.71,5.95 59.71,10.12 59.25,10.57 56.86,10.57 56.41,10.12 56.41,5.95 55.75,5.29 55.95,4.68 57.83,4.78
  pour Bottom (isolate 0.406, no thermals): 63.11,5.44 60.22,5.44 59.71,5.95 59.71,10.12 59.25,10.57 56.86,10.57 56.41,10.12 56.41,5.95 55.9,5.44 48.89,5.44 48.79,5.34
+3V3  (via drill 0.3)  (1 unrouted)
  Top 0.254: J1.18 22.77,44.76 23.29,44.25 v23.29,42.02 24.15,41.15 24.86,41.15 24.91,41.2 24.95,41.17 R34.2 | R8.2 26.38,41.15 | R34.2 25.01,41.15 | R8.2 26.4,41.15 | R8.2 26.35,41.17 26.33,41.15 26.32,41.17 R34.2
  Top 0.406: U5.2 57.46,38.83 v57.32,38.97 | U$2.1 44.01,34.25 43.95,34.31 C40.2 | C40.2 | v43.05,35.62 C40.2
  Top 0.508: 71.9,42.14 71.9,42.17 | 71.9,42.14 R22.2 | v72.81,42.12 71.9,42.12 71.9,42.14
  Route15 0.508: v57.32,38.97 57.32,44.05 60.67,47.4 62.05,47.4
  Route15 0.61: v43.05,35.62 27.6,35.62 23.29,39.94 v23.29,42.02
  Route15 0.813: v72.81,42.12 71.24,43.69 66.77,43.69 63.06,47.4 62.05,47.4 v61.99,47.4
  pour Top (no thermals): 62.45,46.23 63.32,45.37 63.21,45.17 63.72,44.66 64.43,44.66 64.59,44.81 66.06,44.81 66.31,45.07 66.31,45.17 63.82,47.66 61.89,47.66 61.59,47.35 61.59,46.84 62.1,46.39
GND  (via drill 0.3)  (1 unrouted)
  Top 0.254: v34.37,11.68 v34.36,11.69 34.45,11.78 R7.2 | 34.93,11.17 34.92,11.18 | 34.93,11.17 v34.93,11.12 | C15.2 34.95,11.15 34.93,11.17
  Top 0.305: U1.9 31.13,22.38 31.12,22.4 | U1.9 | C19.2 28.08,4.86 28.11,4.83 v28.11,3.61 | 32.53,14.78 32.53,14.74 | C16.2 32.53,14.78 | v33.1,15.95 32.53,15.38 32.53,14.78 | 28.11,17.29 28.11,17.23 | C17.2 28.11,17.29 | v28.1,18.6 28.11,18.59 28.11,17.29
  Top 0.61: C22.2 39.54,23.67 v39.54,22.56 | R6.2 30.67,19.99 30.65,19.97 30.63,19.99 v29.93,19.99
  Route2 0.406: v47.21,2.7 v46.4,2.7 v45.59,2.7 45.59,2.75 v45.59,3.56 v45.59,4.38 v45.59,5.24 v46.4,5.24 v47.21,5.24 47.26,5.24
  Route2 0.813: 45.59,2.75 47.16,2.75
  Route2 1.016: 7.94,9.1 arc-89 12.26,4.83
  Bottom 1.016: 7.94,9.1 arc-89 12.26,4.83
  other vias: 24.35,3.61 32,15.95 24.4,18.6 25.7,3.61 26.49,3.61 27.3,3.61 28.9,3.61 29.69,3.61 30.47,3.61 25.7,18.6 26.5,18.6 27.3,18.6 28.9,18.6 29.7,18.6 30.47,18.6 34.39,11.12 39.29,15.96 30.66,21.84 31.22,21.84 38.93,15.35 23.8,18.6 23.74,3.61 30.09,21.85 30.09,21.29 30.65,21.29 31.21,21.29 32.54,15.95 35.49,11.12 34.93,11.68 12.22,2.79 8.21,9.14 8.26,18.34 9.17,22.5 32.59,4.11 18.57,17.63 18.22,24.64
  pour Top (no thermals): 47.16,5.39 45.64,5.39 45.43,5.19 45.43,2.75 45.64,2.55 47.11,2.55 47.36,2.8 47.36,5.19
  pour Top (no thermals): 23.59,3.66 23.59,3.92 23.84,4.17 24.25,4.17 24.5,3.92 24.5,3.66 24.25,3.46 23.79,3.46
  pour Top (no thermals): 23.64,18.55 23.64,18.35 23.79,18.19 24.45,18.19 24.56,18.29 24.56,18.55 24.35,18.75 23.84,18.75
  pour Top (no thermals): 30.7,22.46 30.3,22.46 29.84,22 29.84,21.24 30.04,21.04 31.51,21.04 31.67,21.19 31.67,22.46
  pour Top (no thermals): 34.05,12.1 34.05,10.78 34.26,10.57 35.63,10.57 35.78,10.73 35.78,11.18 34.87,12.1 34.16,12.1 34.05,12
  pour Top (no thermals): 25.5,16.54 25.5,18.75 30.68,18.75 30.68,16.54
  pour Top (no thermals): 25.5,5.7 25.5,3.46 30.65,3.46 30.65,5.7
  pour Top (no thermals): 31.79,14.15 31.79,16.11 32.28,16.11 33.27,16.11 33.27,15.37 33.27,14.15
  pour Bottom (isolate 0.406): 31.46,21.85 30.5,22.82 30.5,26.32 30.04,26.78 20.9,28.25 17.8,25.15 11.3,25.15 7.79,21.65 7.79,8.74 11.86,8.74 11.91,2.5 33.9,2.5 33.9,9.61 32.28,16.21 37.36,21.29 37.36,16.47 39.34,14.48 40.3,14.48 40.86,15.04 40.86,21.7 39.44,23.12 35.78,23.12 34.66,22 34.66,20.73 33.85,19.92 32.33,19.92 31.46,20.78
  pour Route2 (isolate 0.406): 31.46,21.19 32.63,21.19 34.05,27.03 30.04,26.78 20.19,27.54 17.8,25.15 11.3,25.15 7.79,21.65 7.79,8.74 11.91,8.74 11.91,2.5 33.9,2.5 33.9,9.61 34.26,9.96 35.27,9.96 35.73,10.42 35.73,12.1 35.12,12.71 34.16,12.71 33.65,13.21 33.65,17.94 31.46,20.12
  pour Route2 (isolate 0.406, no thermals): 33.09,2.5 47.31,2.5 47.42,2.6 47.42,5.34 47.31,5.44 34.46,5.44 33.55,6.36 33.09,5.65
  pour Top (no thermals): 40.46,14.48 39.34,14.48 38.93,14.89 38.32,15.5 38.22,15.5 37.97,15.75 37.97,16.62 38.78,16.62 38.93,16.47 39.19,16.21 39.39,16.21 40.1,15.5 40.46,15.5
  pour Route2 (isolate 0.406, no thermals): 31.46,21.85 31.46,20.78 32.33,19.92 33.85,19.92 34.66,20.73 34.66,22 35.78,23.12 39.44,23.12 40.86,21.7 40.86,15.04 40.3,14.48 39.34,14.48 37.36,16.47 37.36,19.51 36.95,19.92 35.99,19.92 33.29,17.23 30.7,17.23 29.79,18.14 29.79,20.94 30.7,21.85
  pour Bottom (isolate 0.406, no thermals): 33.45,9.15 34.26,9.96 35.27,9.96 35.73,10.42 35.73,12.1 35.12,12.71 34.16,12.71 32.78,14.08 32.78,9.71
  pour Bottom (isolate 0.406, no thermals): 10.08,8.79 10.08,8.49 11.55,7.02 11.65,7.02 12.46,7.83 12.46,8.79 11.65,9.61 9.37,13.06 7.84,12.15 7.84,9.35
  pour Bottom (isolate 0.406, no thermals): 33.09,2.5 47.31,2.5 47.42,2.6 47.42,5.34 47.31,5.44 34.46,5.44 33.55,6.36 33.09,5.65
  pour Bottom (isolate 0.406, no thermals): 31.77,13.11 33.5,13.11 33.65,13.27 33.65,17.79 32.68,18.75 32.68,18.35 31.21,16.87 31.21,13.67
  pour Bottom (isolate 0.406, no thermals): 35.27,19.92 36.95,19.92 37.51,19.36 38.12,19.77 40.1,22.21 39.64,22.66 36.09,22.66 35.27,21.85
  pour Route2 (no thermals): 9.01,9.76 9.82,8.79 12.01,6.97 12.01,2.6 12.46,2.6 12.46,9.15 11.14,10.32 10.33,11.94 8.3,11.79 8.1,10.32
GNDA  (via drill 0.3)  (1 unrouted)
  Top 0.254: 32.11,26.95 32.12,26.93 32.13,26.94 v32.16,26.94
  Top 0.305: U1.15 | 32.11,26.95 U1.16 | U1.15 | U1.15 31.96,26.3 32.17,26.52 32.17,26.93 v32.17,26.93 v32.16,26.94
  Top 0.406: v44.52,25.15 | v44.52,25.15 | U2.3 v44.52,25.14 v44.52,25.15
  Top 0.61: R5.2 | R5.2 20.7,26.33 C3.2 | v20.71,28.57 20.71,27.61 R5.2 | 35.18,26.69 35.17,26.68 | C32.1 35.18,26.69 | v35.21,27.6 35.21,26.72 35.18,26.69 | 33.6,21.95 C20.2 v33.6,21.09 | C5.2 v29.57,28.41
  Top 0.813: C5.2 30.4,28.4
  Route15 0.305: v37.55,25.11 37.4,25.25 35.12,25.25 34.66,24.8 33.29,24.8 32.78,25.3 32.78,26.32 32.17,26.93
  pour Bottom (isolate 0.406): 46.6,24.44 46.6,25.61 45.69,26.52 38.42,26.52 35.17,29.78 20.54,29.78 19.98,29.22 19.98,26.32 21.46,22.41 30.45,22.97 30.7,23.17 31.26,23.17 32.12,22.31 32.12,21.19 32.58,20.73 33.5,20.73 33.85,21.09 33.85,22.31 35.48,23.93 41.01,23.93 42.13,22.82 45.69,22.82 46.6,23.73 46.6,24.49
  pour Route2 (isolate 0.406): 46.6,24.44 46.6,25.61 45.69,26.52 38.42,26.52 35.17,29.78 20.54,29.78 19.98,29.22 19.98,26.63 19.02,23.73 18.76,20.99 31.51,21.04 31.67,21.19 31.87,21.44 32.58,20.73 33.5,20.73 33.85,21.09 33.85,22.31 35.48,23.93 41.01,23.93 42.13,22.82 45.69,22.82 46.6,23.73 46.6,24.49
I2C_SCL  (via drill 0.3)
  Top 0.254: R34.1 25.01,42.83 | J1.19 23.44,45.26 v25.01,43.69
  Top 0.406: U$2.3 43.05,31.71 40.1,34.65 28.92,34.65 25.01,38.56 v25.01,39.83
  Top 0.61: v25.01,43.69 R34.1
  Route15 0.406: v25.01,39.83 v25.01,43.69
I2C_SCL2  (via drill 0.3)
  Top 0.406: v54.07,36.58 54.07,36.63 54.26,36.44 U5.6 | U$2.6 v50.77,31.71
  Route15 0.406: v50.77,31.71 51.48,31.71 54.07,34.3 v54.07,36.58
I2C_SDA  (via drill 0.3)
  Top 0.254: R8.1 26.38,42.83 | v26.38,43.69 26.38,43.75 24.36,45.76 J1.20
  Top 0.406: 44.27,32.98 U$2.2 43,32.98 40.46,35.52 29.33,35.52 26.38,38.46 v26.38,39.83
  Top 0.61: v26.38,43.69 R8.1
  Route15 0.406: v26.38,39.83 v26.38,43.69
I2C_SDA2  (via drill 0.3)
  Top 0.406: U5.7 54.3,35.79 v52.65,34.14 R33.2 | U$2.7 49.65,32.98 49.7,33.03 49.75,32.98 v50.77,32.98
  Route15 0.406: v50.77,32.98 51.48,32.98 v52.65,34.14
N$1
  Top 0.61: T1.7 56.9,17.42 56.91,17.43 56.9,17.45 T1.6 59.42,17.5 | 59.42,17.5 D7.2 59.49,17.5 59.56,17.43 59.8,17.67 R18.1 | 59.42,17.5 59.51,17.58
  pour Top (no thermals): 59.81,17.99 56.86,17.99 56.41,17.53 56.41,15.45 57.22,14.64 57.17,15.17 59.56,17.23 59.56,17.74
  pour Top (no thermals): 62.27,17.96 60.57,17.96 60.55,17.99 57.68,17.99 57.63,17.94 57.6,17.99 56.41,17.99 56.41,14.51 57.37,14.51 57.37,15.14 59.23,17 60.57,17 60.95,17.38 62.27,17.38
N$2
  Top 0.305: 53.56,25.1 54.79,23.87 54.8,23.88 54.85,23.88 | C11.1 53.55,25.11 53.51,25.15 53.5,25.14 U2.2 | D8.S 54.85,23.88 | 54.85,23.88 54.88,23.88
  Top 0.61: C11.1 53.56,25.1 53.55,25.11 C33.1
N$3
  Top 0.61: C13.1 61.89,14.69 61.94,14.74 R18.2
  pour Top (no thermals): 62.27,15.55 62.27,14.89 61.61,14.89 61.61,15.88 62.27,15.88
N$4
  Top 0.254: J1.6 14.76,43.26 13.5,42 13.5,38.4 14.65,37.25 14.65,31.95 J3.2
N$5
  Top 0.254: J3.4 16.71,28.41 17.5,29.2 17.5,36.9 15.3,39.1 15.3,41 16.06,41.76 J1.9
N$6
  Top 0.254: J1.10 16.36,41.26 15.9,40.8 15.9,39.3 18.1,37.1 18.1,29 16.24,27.14 J3.5
N$7  (via drill 0.3)
  Top 0.61: v14.3,9 v14.3,9.7 | v14.3,9.7 13.7,9.4 14.3,9.4 v14.3,9 | D1.3 13.2,9.4 | D1.3 | v14.3,9 13.2,9 D1.3 | v14.3,9.7 13.2,9.7
  Route15 0.813: v14.3,9 v14.3,9.7 12.9,11.1 12.9,19.31 11.91,20.3 11.91,21.6 | 11.91,21.6 | 11.91,21.6 J3.8
  pour Top (no thermals): 12.85,9.91 14.47,9.91 14.47,8.85 12.85,8.85
N$8  (via drill 0.3)
  Top 0.61: v14.3,6.5 v14.3,7.2 13.7,7.2 13.7,6.9 14.3,6.9 v14.3,6.5 | D1.2 13.2,6.5 v14.3,6.5
  Route15 0.813: v14.3,6.5 14.3,6.9 | 14.3,6.9 v14.3,7.2 15.05,7.2 | 14.3,6.9 14.3,6.45 15.05,7.2 | 15.05,7.2 16.2,8.35 16.2,10.3 15.5,11 15.5,18.89 17.9,21.29 17.9,21.34 | J3.7 16.2,24.6 17.9,22.9 17.9,21.34 | 17.9,21.34 17.9,21.3 | 17.9,21.34
  pour Top (no thermals): 12.85,7.37 14.47,7.37 14.47,6.31 12.85,6.31
N$9
  Top 0.254: J1.1 10.96,45.76 5.4,40.2 5.4,35.3 3.22,33.12 | 3.22,33.12 3.2,33.1 | J3.11 3.22,33.12
  Route15 0.305: J3.13 3.22,28.12 4.8,29.7 4.8,31.5 3.2,33.1 3.22,33.12 J3.11
N$10  (via drill 0.3)
  Top 0.61: v14.3,14.8 v14.3,15.5 13.8,15.5 13.8,15 14.3,15 v14.3,14.8 | D5.3 13.2,15.2 | D5.3 | v14.3,14.8 13.2,14.8 D5.3
  Route2 0.813: v14.3,15.5 v14.3,14.8 14.3,17.1 13.65,17.75 J3.10
  pour Top (no thermals): 12.85,15.7 14.47,15.7 14.47,14.71 14.47,14.64 12.92,14.64 12.85,14.64
N$11  (via drill 0.3)
  Top 0.61: D5.2 13.2,12.61 | v14.3,12.3 v14.3,13 13.7,13 13.7,12.5 14.3,12.5 v14.3,12.3 | D5.2 | v14.3,12.3 13.2,12.3 D5.2
  Route2 0.813: v14.3,13 v14.3,12.3 v14.3,13 | v14.3,13 15,13 15.4,13.4 | 15.4,13.4 16.2,14.2 16.2,22.08 | 15.4,13.4 14.45,12.45 | 16.2,22.08 16.2,22.1 | 16.2,22.08 J3.9
  pour Top (no thermals): 12.85,13.16 14.47,13.16 14.47,12.17 14.47,12.12 12.92,12.12 12.85,12.12
N$12
  Top 0.254: J1.3 11.56,44.76 8.2,41.4 R1.2 8.2,39.2
N$13
  Top 0.254: J1.2 11.26,45.26 6.5,40.5 R2.2 6.5,39.2
N$14  (via drill 0.3)
  Top 0.305: v6.5,36.45 R2.1
  Route2 0.305: J3.14 4.8,21.48 4.8,34.75 v6.5,36.45
N$15
  Top 0.254: J3.12 4.57,29.25 9.8,29.25 10.8,30.25 10.8,31.7 12.3,33.2 12.3,35.05 11.15,36.2 8.7,36.2 8.2,36.7 8.2,37.6
  Top 0.305: 8.2,37.6 R1.1
N$16
  Top 0.305: 22.4,26.3 C3.1 U1.2
N$17  (via drill 0.3)
  Top 0.254: 13.1,43.9 13.1,44.01 13.35,44.26 J1.4
  Top 0.305: 9.89,37.49 9.95,37.55 v11.6,37.55 | 9.89,37.49 C1.1 | 9.89,37.49 9.85,37.45 | v11.6,37.55 | v11.6,37.55 11.65,37.6
  Top 0.406: v11.6,37.55 11.6,42.4 13.1,43.9
  Route15 0.406: J3.3 14.9,30.96 14.9,34.25 v11.6,37.55
N$18
  Top 0.305: C20.1 33.58,23.7 U1.11 | 33.6,23.58 35.27,21.9 35.27,21.92 R35.2 35.22,21.29 36.19,20.33 36.85,20.33 37.51,19.67 37.51,18.85 37.92,18.45 38.32,18.45 38.32,18.67 D2.C | D2.C 38.45,18.7 38.47,18.7 38.47,18.02 C2.1 | 38.73,18.24 38.73,18.35 38.52,18.55 38.52,18.6 38.37,18.75 | 38.37,18.75 | D2.C 38.37,18.75
  Top 0.406: C20.1 33.6,23.58
N$19
  pour Top (no thermals): 38.45,21.1 39.75,21.1 40,20.85 40,20.45 39.95,20.4 39.05,20.4 38.55,20.9 38.55,21.05 38.5,21.1
N$20
  Top 0.813: T1.5 | R3.1 | T1.5 R3.1
N$21
  Top 0.305: R4.2 22.35,25 | R4.2 | R4.2 U1.4
  Top 0.61: 22.4,25.02 22.37,25.05 | 22.4,25.02 R4.2 | C10.1 22.43,25 22.4,25.02
N$22
  Top 0.305: U1.1 23.85,26.95 23.2,27.6 R5.1 | R5.1
N$23
  Top 0.254: D3.A | D3.A 38.19,12.51
  Top 0.813: T1.3 39.9,12.51 | T1.3 | T1.3 39.89,12.51
  pour Top (isolate 0.406, no thermals): 40.46,13.01 36.49,13.01 36.49,12.76 36.49,12 39.9,12 40.46,12
N$24
  Top 0.305: 37.71,14.79 37.71,14.74 | Q1.G 37.71,14.79 | 37.26,15.25 37.71,14.79 | R6.1 32.43,19.97 32.43,20.17
  Top 0.406: 32.43,22.82 32.53,22.82 32.63,22.92 32.5,23.05 U1.10
  Top 0.813: 32.43,20.17 32.43,22.82 | R6.1 34.24,19.99 36.29,17.94 36.29,16.21 37.26,15.25
  pour Top (no thermals): 37.97,14.54 37.46,14.54 37.2,14.79 37.2,15.04 37.51,15.35 37.81,15.04 37.97,15.04
N$25  (via drill 0.3)
  Top 0.61: v36.54,21.14 R39.2
  Top 0.813: R7.1 | R7.1 | 34.41,14.13 34.41,14.14 R7.1
  Route15 0.305: v36.54,21.14 36.54,19.92 34.61,17.99 v34.61,14.89
  pour Top (isolate 0.406, no thermals): 36.09,15.09 34.05,15.09 34.05,14.13 34.46,13.82 34.92,13.82 35.53,14.43 36.09,14.43
N$26  (via drill 0.3)
  Top 0.254: 19.33,15.17 D5.4
  Top 0.61: v18.2,15.5 18.8,15.5 18.2,14.9 v18.2,14.8 | 19.29,15.19 19.3,15.2 | 19.29,15.19 D5.4 | v18.2,14.8 18.9,14.8 19.29,15.19 | v18.2,9.7 18.8,9.1 18.8,9 v18.2,9 v18.2,9.7 | v18.2,9.7 18.9,9.7 19.23,9.37 D1.4 18.96,9.7 v18.2,9.7 | 19.33,15.17 19,15.5 v18.2,15.5 | v18.2,14.8 v18.2,15.5
  Top 0.813: 19.3,9.38 19.3,9.4 | 19.3,9.38 D1.4 19.29,9.59 | 19.3,9.38 19.42,9.5 20.1,9.5 | D6.2 20.95,9.6 C4.2 20.87,9.5 20.1,9.5 | 24.15,9.5 R36.2 22.7,9.5 | 20.1,9.5 22.7,9.5 | 22.7,9.5 C6.2
  Route15 0.813: v18.2,9.7 v18.2,9 18.2,10.4 16.9,11.7 16.9,13.5 v18.2,14.8 v18.2,15.5
  pour Top (no thermals): 18.05,9.86 18.05,9.91 19.88,9.91 20.19,10.22 22.02,10.22 22.27,10.47 23.08,10.47 23.74,9.81 24.48,9.81 24.48,9.25 22.02,9.25 21.3,8.54 21.3,7.78 20.59,7.78 20.59,8.64 20.29,8.95 20.29,8.85 18.05,8.85 18.05,9.89
  pour Top (no thermals): 24.48,9.15 24.48,9.76 23.64,9.76 23.64,9.15
  pour Top (no thermals): 19.63,15.7 18.05,15.7 18.05,14.64 19.63,14.64
N$27
  Top 0.305: R9.1 23.05,21.1 23.9,21.95 23.9,23.45 24.15,23.7 U1.6 | U1.6
N$28
  Top 0.305: U5.4 56.06,38.07 56.05,38.06 | U5.16 59,37.18 59,37.34
  Top 0.406: U5.4 56.16,38.98 56.91,39.73 58.54,39.73 59,39.27 59,38.16 | 59,38.16 59,38.06 | 59,38.16 59,37.34 | R30.1 56.49,30.5 56.46,30.54 R29.1 R32.1 | R32.1 55.17,30.5 55.14,30.54 | R31.1 R32.1 | R31.1 53.88,30.5 53.87,30.49 | R31.1 52.69,30.5 52.65,30.54 R33.1 51.63,31.52 51.63,33.48 50.87,34.25 U$2.8 49.7,34.25 49.87,34.41 C39.2
  Top 0.508: 52.65,38.06 C31.2 | 52.65,38.06 56.05,38.06 | 52.65,38.06 52.39,38.06 49.95,35.62 C39.2 49.87,35.81 47.62,38.06 C37.1 47.31,38.06 47.45,38.2 U$1.S
N$29
  Top 0.305: R10.1 23.1,22.4 23.35,22.65 23.35,23.85 23.85,24.35 U1.5 | U1.5
N$30
  Top 0.305: U1.7 24.6,23.05 24.45,22.9 24.45,21.35 R12.1 24.75,21.05
N$31  (via drill 0.3)
  Top 0.305: U1.14 33.35,25.65 v33.47,25.64
  Top 0.406: U2.4 v44.52,23.87 v44.52,23.88
  Top 0.61: R11.1 33.53,26.69 33.55,26.68 33.47,26.6 v33.47,25.64
  Route15 0.305: v44.52,23.88 43.71,23.88 41.52,26.07 33.9,26.07 v33.47,25.64
N$32
  Top 0.254: 16.2,32.2 J3.1 15.3,33.1 15.3,37.45 14.1,38.65 14.1,41.85 15.01,42.76 J1.7
N$33
  Top 0.61: R11.2 33.39,28.39 33.39,28.4 C5.1
N$34
  Top 0.813: R37.2 | C36.1 36.9,9.2 R37.2 | C36.1
  pour Top (no thermals): 37.81,9.46 37.81,10.27 38.02,10.47 38.37,10.47 38.58,10.27 38.58,9.56 38.53,9.51 37.81,9.51
  pour Top (no thermals): 36.49,8.85 38.58,8.85 38.58,9.25 38.58,10.22 38.37,10.42 38.02,10.42 37.86,10.27 37.86,9.91 37.86,9.71 37.81,9.66 37.71,9.56 36.49,9.56
N$35
  Top 0.305: R16.1 53.52,23.46 53.12,23.87 U2.1
N$36
  Top 0.305: 56.75,25.06 56.76,25.05 | R15.1 56.75,25.06 | 56.75,25.06 56.71,25.1
  Top 0.61: R15.1 56.6,25.06 56.56,25.1 C11.2
N$37
  Top 0.305: R15.2 56.61,26.78 58.03,25.36 58.03,23.83 | 55.26,26.4 55.24,26.37 | C33.2 55.26,26.4 | 55.26,26.4 55.65,26.78 | 57.98,23.78 58.02,23.78 R13.2 | 59.34,23.78 R14.2 | 58.05,23.77 57.94,23.87
  Top 0.61: 59.34,23.78 58.13,23.78 58.08,23.73 58.05,23.77 R13.2 58.03,23.83 57.99,23.87 D8.G | C33.2 55.31,26.4 55.68,26.76 R15.2
N$38
  Top 0.813: R37.1 38.15,7.5 | R37.1 T1.1 | 36.88,7.5 C36.2 | 36.88,7.5 R37.1 | 36.88,7.5 36.47,7.5 36.14,7.17 34.97,7.17 34.97,7.16 C15.1
  pour Top (no thermals): 34.21,7.78 33.34,8.64 31.67,8.64 31.67,8.44 33.65,6.46 34.05,6.46 34.26,6.66 34.26,7.58
  pour Top (no thermals): 40.4,7.98 39.39,7.98 39.24,7.83 36.44,7.83 36.39,7.78 34.11,7.78 33.39,8.49 33.39,8.9 31.72,8.9 31.72,8.49 33.7,6.51 36.09,6.56 38.68,6.56 39.19,7.02 40.4,7.02
N$39  (via drill 0.3)
  Top 0.61: v53.56,20.89 R16.2 | 59.35,22.1 R14.1 v59.35,21.19
  Route15 0.813: v53.56,20.89 58.59,20.89 58.9,21.19 v59.35,21.19 61.28,21.19 63.62,18.85 63.62,12.45 65.14,10.93 65.14,7.42 | 65.14,7.42 v65.14,7.32 | v64.79,6.81 65.14,7.17 65.14,7.42
  pour Top (isolate 0.406, no thermals): 64.53,6.2 64.53,7.02 64.64,7.12 64.69,7.17 64.69,8.39 66.47,8.39 66.47,7.58 66.47,5.49 64.53,5.49
N$43  (via drill 0.3)
  Top 0.305: U1.13 | U1.13 v32.12,25
  Top 0.61: R39.1 | R39.1 C22.1 | v36.54,24.49 R39.1
  Route15 0.305: v32.12,25 33.09,24.04 35.22,24.04 36.09,24.04 v36.54,24.49
N$44
  Route2 0.254: 4.73,15 7.13,15 7.13,13 4.73,13 4.73,15
N$45
  Route15 0.254: 4.73,13 7.13,13 7.13,11 4.73,11 4.73,13
N$46
  Bottom 0.254: 4.73,11 7.13,11 7.13,9 4.73,9 4.73,11
N$47
  pour Top (no thermals): 68.09,27.34 70.22,27.34 71.34,28.45 72.76,28.45 73.88,27.34 73.88,26.78 73.63,26.52 73.53,26.42 71.7,26.42 71.34,26.42 70.63,25.71 70.38,25.46 69.87,25.46 69.01,26.32 68.55,26.32 68.4,26.32 68.09,26.63
N$48
  Top 0.508: 69.5,41.7 69.49,41.69 U4.5 | 69.45,43.75 C28.1 69.4,43.9 69.45,43.85
  Top 0.813: 71.75,43.59 71.75,43.58 C43.2 | 71.75,43.59 R25.1 | 71.75,43.59 71.75,43.64
  Top 0.914: C43.2 71.85,43.59
  pour Top (no thermals): 71.39,43.85 70.99,44.25 70.38,44.25 69.16,42.93 69.31,42.78 69.31,42.17 69.46,42.02 70.22,42.02 70.33,42.02 70.53,42.22 70.53,42.78 70.83,43.08 71.24,43.08 71.39,43.24 71.49,43.34 71.49,43.75
N$49
  Top 0.305: U1.12 32.54,24.35 33.09,24.9 35.22,24.9 C32.2 | C32.2 35.27,24.89 | C32.2 35.23,24.94 35.27,24.9 35.22,24.85 R35.1
N$50
  pour Top (no thermals): 70.02,29.98 70.94,29.98 71.34,30.38 72.21,30.38 72.82,30.99 73.73,31.91 73.78,31.91 74.09,31.6 74.09,30.38 73.83,30.13 71.85,30.13 71.24,30.13 70.38,29.27 70.33,29.22 70.12,29.22 70.02,29.22
N$51
  pour Top (no thermals): 70.12,30.99 70.68,30.99 71.09,31.4 71.09,32.06 70.53,32.62 70.53,33.74 70.33,33.94 69.97,33.94 69.97,31.15
N$52
  Top 0.254: 7.13,15 7.13,17.01 4.73,17.01 4.73,15 7.13,15
N$53
  Top 0.508: C30.1 67.83,39.1 U4.1
N$54
  Top 0.508: U3.3 68.2,28.9 67.4,28.1 66.52,28.1 66.52,28.06 R21.1 | R21.1 66.5,28 | R21.1 66.5,28.1 66.43,28.03 | R21.1 66.45,28.05 66.4,28 66.5,27.9 66.5,26.89 | R21.1 66.52,28.05 | R21.1 | C26.2 65.18,28.05 R21.1 | 66.5,26.89 R20.2 | 66.5,26.89 66.52,26.88
N$55
  Top 0.508: 67.1,41.68 67.1,41.65 | 67.1,41.68 67.1,41.7 | 67.1,41.68 C30.2 67,41.6
  Top 0.61: 67,41.7 C30.2 67,41.65
  pour Top (no thermals): 67.18,41.31 68.45,41.31 68.65,41.51 68.65,42.42 67.89,43.19 64.99,43.19 64.74,42.93 64.94,42.93 66.57,41.31 67.53,41.31
N$56
  Top 0.508: R23.2 71.85,39.2 71.9,39.2 | R23.2 71.8,39.2 71.7,39.1 U4.3 | 71.93,39.14 71.95,39.12 | R23.2 71.93,39.14 | R22.1 71.86,39.21 71.93,39.14
N$57  (via drill 0.3)
  Top 0.305: 55.4,45.5 | J2.9 53.8,45.5 55.4,45.5
  Top 0.406: U5.1 58.11,38.85 v58.24,38.97
  Top 1.016: v61.99,43.95 61.95,43.95 61.94,43.95 60.39,45.5 55.4,45.5
  Route15 0.508: v58.24,38.97 58.24,42.93 59.25,43.95 v61.99,43.95 | v61.99,43.95 | v61.99,43.95
  pour Top (no thermals): 49.5,45.75 48.85,45.75 48.85,45.25 55.3,45.25 55.3,45.75 54.35,45.75 48.85,45.75
  pour Top (no thermals): 62.15,43.59 62.4,43.85 62.4,45.22 60.83,45.22 62.15,43.9
N$59
  Top 0.406: U5.10 56.81,33.43 56.41,33.03 56.41,32.16 56.42,32.16 R29.2
N$60  (via drill 0.3)
  Top 0.305: R28.2 | v63.71,34.45 R28.2
  Top 0.406: v60.01,35.62 60.01,35.57 59.79,35.79 U5.14
  Top 1.016: 55.4,43.5 59.54,43.5 63.72,39.37 63.72,33.61 R28.2
  Route15 0.508: v63.71,34.45 63.71,36.9 62.35,38.26 60.22,38.26 59.05,37.09 59.05,36.07 59.51,35.62 v60.01,35.62
  pour Top (no thermals): 48.85,43.75 48.85,43.25 55.5,43.25 55.5,43.75
N$61
  Top 0.406: U5.13 59.27,35.14 59.56,34.86 59.56,32.32 59.45,32.21 59.47,32.2 R30.2
N$62
  Top 0.406: U5.9 56.16,33.95 55.19,32.98 R32.2
N$63
  Top 0.406: U5.8 54.81,35.14 53.92,34.25 R31.2
N$64
  Top 0.254: 14.1,38.65 14.1,40.55
N$65
  Top 0.254: 15.5,42.25 14.7,41.45 14.7,38.9 16.35,37.25 16.35,35
N$66
  Top 0.254: 14.3,43.75 12.9,42.35 12.9,37.7 13.55,37.05
N$67
  Top 0.1: 13.28,43.86 13.62,44.2 13.62,44.22 13.53,44.22 13.29,43.98
N$68
  Top 0.61: C13.2 59.59,12.91 D7.1 59.44,13.06 59.56,13.06 59.56,12.84 61.52,11.08 | C12.1 61.79,5.98 61.79,7.83 61.82,7.83 C21.1 61.69,8.06 61.69,8.64 61.69,9.96 61.52,11.08 | 61.52,11.08 C18.1
  Top 1.016: C21.1 61.87,7.91 61.89,7.93 61.94,7.88
  pour Top (no thermals): 61.28,5.34 61.28,10.62 59.25,12.66 59.45,12.66 60.37,13.57 60.52,13.57 61.13,12.96 61.99,12.96 62.25,12.71 62.25,10.83 62.45,10.62 62.45,5.65 62.1,5.29 61.39,5.29 61.28,5.39
  pour Top (no thermals): 60.93,13.21 60.55,13.6 60.29,13.6 59.3,12.6 61.23,10.67 61.23,5.16 62.5,5.16 62.5,10.62 62.33,10.83 62.33,13.27 60.9,13.27 60.78,13.37
  pour Top (isolate 0.406, no thermals): 62.6,5.39 62.71,5.49 63.62,5.49 63.62,6.36 62.86,6.36 62.71,6.36 62.55,6.51 62.55,5.39
N$69  (via drill 0.3)
  Top 0.61: v18.2,13 18.8,13 18.8,12.9 v18.2,12.3 | v18.2,12.3 19,12.3 19.3,12.6 19.29,12.61 D5.1 18.92,13 v18.2,13 | v18.2,7.2 18.2,7.1 18.8,6.5 v18.2,6.5 v18.2,7.2 | D1.1 19.29,6.89 19.3,6.9 19,7.2 v18.2,7.2 | v18.2,12.3 v18.2,13
  Top 0.813: 19.3,12.6 19.3,12.62 | 19.3,12.62 D5.1 19.29,12.41 | C6.1 22.82,12 22.7,12.12 22.7,12.5 | 20.95,12.4 C4.1 20.87,12.5 20.05,12.5 | 19.3,12.62 19.42,12.5 20.05,12.5 | 19.25,6.87 19.25,6.9 | D1.1 19.25,6.87 | D6.1 19.25,6.65 19.25,6.87 | R38.2 22.7,12.5 | 20.05,12.5 22.7,12.5
  Route2 0.813: v18.2,13 v18.2,12.3 16.88,10.98 16.88,10.37 | v18.2,6.5 v18.2,7.2 16.88,8.52 16.88,10.37 | 16.88,10.37 16.88,10.57
  pour Top (no thermals): 18.05,13.16 19.68,13.16 19.83,13.01 21.76,13.01 21.94,12.83 24.48,12.83 24.48,12.17 23.36,12.17 23.08,11.89 23.08,11.49 22.32,11.49 22.02,11.79 20.19,11.79 19.88,12.1 18.05,12.1
  pour Top (no thermals): 18.05,7.37 19.63,7.37 19.63,6.56 20.95,5.24 21.33,5.24 21.33,4.63 20.59,4.63 20.59,5.04 20.54,5.04 19.27,6.31 18.05,6.31
N$70  (via drill 0.3)
  Top 0.305: R27.2 | R27.2 61.79,35.52 v61.79,36.38
  Top 0.406: U5.11 v57.46,33.14 v57.47,33.13
  Top 1.016: 60.67,39.43 58.6,41.5 55.4,41.5 | 60.67,39.43 60.7,39.4 | 60.67,39.43 61.82,38.28 R27.2
  Route15 0.508: v57.47,33.13 57.47,33.59 57.88,33.99 61.23,33.99 61.79,34.55 v61.79,36.38
  pour Top (no thermals): 48.85,41.75 48.85,41.25 55.7,41.25 55.7,41.75
PE  (via drill 0.3)  (21 unrouted)
  other vias: 8,6.65 9.45,3.15 6.55,3.15 9.45,6.05 6.55,6.05 10.05,4.6 5.95,4.6 8,2.55 9.45,47.15 9.45,50.05 8,50.65 8,46.55 10.05,48.6 6.55,50.05 5.95,48.6 6.55,47.15
PE1  (via drill 0.3)  (7 unrouted)
  other vias: 76.9,6.05 79.8,6.05 76.9,3.15 79.8,3.15 80.4,4.6 78.35,2.55 78.35,6.65 76.3,4.6
PE2  (via drill 0.3)  (7 unrouted)
  other vias: 76.9,50.05 79.7,50.05 76.9,47.15 79.7,47.15 80.3,48.6 78.35,46.55 78.35,50.65 76.3,48.6
V+  (via drill 0.3)
  Top 0.305: C8.2 24.09,15.96 23.49,15.96 v23.18,15.65
  Top 0.813: 24.12,16 C8.2 R38.1 | v23.18,15.65 v23.18,16.31 | v19.83,25 R4.1
  Route15 0.813: v19.83,25 19.48,24.64 19.48,19.26 22.42,16.31 | 22.42,16.31 23.08,15.65 v23.18,15.65 v23.18,16.31 22.42,16.31
  pour Top (no thermals): 24.05,13.85 24.75,13.85 25.5,13.1 25.5,10.4 30.6,10.4 30.65,10.45 30.65,11.15 30.85,11.35 31.7,11.35 31.95,11.6 31.95,12.65 31.4,12.65 31.05,12.65 30.75,12.95 26.25,12.95 26.25,13 24.8,14.45 24.7,14.55 24.25,14.55 24.05,14.35
  pour Top (no thermals): 31.7,10.7 31.7,11.15 31.5,11.35 33.3,11.35 33.3,11 33.4,10.9 31.8,10.8
  pour Top (no thermals): 23.03,15.58 23.16,15.45 23.69,15.45 23.69,13.87 24.81,13.87 25.5,13.19 25.5,9.23 30.68,9.23 30.68,11.18 30.93,11.44 31.46,11.44 31.69,11.21 31.69,10.55 32.2,10.55 32.2,10.52 31.69,10.5 33.39,10.5 33.39,10.85 33.29,10.95 33.29,12.63 31.03,12.63 30.73,12.94 26.26,12.94 24.48,14.71 24.48,16.34 23.51,16.34 23.34,16.52 23.11,16.52
V-  (via drill 0.3)
  Top 0.305: 57.14,36.11 57.22,36.02 | 57.14,36.11 U5.PAD | 56.81,36.89 56.81,36.43 57.14,36.11
  Top 0.406: v60.01,36.58 60.01,36.63 59.82,36.44 U5.15 | U5.3 56.81,36.89 v56.41,36.89 56.2,36.89 56,37.09 U5.5 | U$2.5 v50.77,30.44 | C39.1 48.12,35.58 48.13,35.57 48.08,35.52 v48.08,34.6
  Top 0.508: C37.2 45.59,38.06 45.55,38.09 | U$1.G 45.48,39.17
  Top 0.813: 52.61,36.32 52.6,36.33 | C31.1 52.61,36.32 | v52.65,35.47 52.65,36.28 52.61,36.32
  Route15 0.508: v60.01,36.58 60.78,37.34 61.94,37.34 62.76,36.53 62.76,32.01 v63.72,31.05
  other vias: 44.72,38.41 57.88,36.89 56.41,35.36 57.88,35.36 64.74,30.59 65.4,30.59
  pour Top (no thermals): 68.09,33.99 67.89,33.99 65.4,31.5 64.84,31.5 64.79,31.45 64.79,29.42 66.87,29.42 66.87,30.18 66.47,30.59 66.47,31.71 67.07,32.32 67.94,32.32 67.99,32.26 68.24,32.52 68.24,33.84
  pour Top (no thermals): 64.69,32.26 63.26,32.26 63.26,29.42 63.32,29.37 66.92,29.37 66.92,30.13 66.06,30.99 64.89,32.26 64.48,32.26
  pour Route15 (no thermals): 64.59,30.69 63.98,30.08 59.3,30.08 56.71,32.67 56.71,33.48 56.71,33.94 57.93,35.16 58.08,35.31 58.08,36.99 56.71,38.36 52.85,38.36 52.5,38.36 50.51,36.38 48.02,36.38 45.59,38.82 45.48,38.92 44.77,38.92 44.47,38.61 44.47,38.26 47.67,35.06 47.67,34.7 47.67,34.5 48.69,33.48 48.69,31.15 49.8,30.03 50.87,30.03 51.17,30.33 51.17,30.54 50.92,30.79 50.36,30.79 49.7,31.45 49.7,34.04 50.56,34.91 50.82,35.16 52.6,35.16 53.1,35.67 53.1,36.79 53.71,37.4 54.43,37.4 54.78,37.4 55.49,36.68 55.49,32.47 58.08,29.88 58.69,29.27 62.71,29.27 64.64,29.27 65.6,30.23 65.75,30.38 65.75,30.74 65.55,30.94 65.09,30.94 64.84,30.94
  pour Top (no thermals): 45.48,37.65 45.08,37.65 43.86,38.87 43.86,39.73 44.72,39.73 44.98,39.48 45.03,39.43 45.84,39.43 45.84,38.67 46.04,38.46 46.04,37.65
VCC  (via drill 0.3)
  Top 0.406: v58.39,33.13 58.39,33.08 58.11,33.35 U5.12
  Route15 0.508: v61.82,32.77 61.8,32.77 61.44,33.13 v58.39,33.13
  other vias: 74.39,24.49 73.22,46.14 73.77,46.14 73.88,24.49 61.52,27.26 62.12,27.26 65.09,18.65 65.6,18.65 66.11,18.65
  pour Top (no thermals): 61.42,33.67 61.42,27.56 61.22,27.36 61.22,27.16 61.42,26.96 62.22,26.96 62.42,27.16 62.42,27.36 62.22,27.56 62.22,33.57 62.12,33.67
  pour Top (no thermals): 73.83,24.95 73.68,24.8 73.68,24.39 73.78,24.29 74.39,24.29 74.49,24.29 74.64,24.44 74.64,24.75 74.54,24.85 73.93,24.85
  pour Top (no thermals): 73.02,46.23 73.02,45.83 73.17,45.68 73.88,45.68 73.98,45.78 73.98,46.23 73.88,46.34 73.12,46.34
  pour Route15 (rank 2, no thermals): 64.89,18.5 66.41,18.5 67.68,19.77 73.83,19.77 75.86,21.8 75.86,44.81 73.88,46.79 73.27,46.79 72.92,46.44 72.92,44.2 74.69,42.42 74.69,36.94 74.14,36.38 74.14,26.98 73.63,26.47 73.63,24.19 73.93,23.88 73.93,22.26 73.22,21.55 67.43,21.55 62.5,26.47 62.5,27.29 62.15,27.64 61.49,27.64 61.13,27.29 61.13,26.22 64.89,22.46
  pour Top (isolate 0.406, no thermals): 64.69,9.91 66.41,9.91 66.41,10.32 66.26,10.47 66.26,18.9 64.89,18.9 64.89,10.52 64.69,10.32
VSS  (via drill 0.3)
  Top 0.305: U1.8 26.53,22.4 27.25,23.12 27.25,23.27 | U1.PAD 28.36,24.7 | U1.PAD | v27.45,23.07 U1.PAD | 26.38,21.08 26.38,21.04 26.43,21.09 v27.25,21.09 | R12.2 26.38,21.08 | 26.38,21.08 26.38,21.09 | C9.1 24.05,6.25 23.49,6.25 v23.13,5.9 | v27.45,23.07 27.45,23.48 | 27.25,23.27 27.25,23.48 | 27.25,23.27 v27.45,23.07
  Top 0.61: R10.2 20.75,22.36 | R10.2 20.7,21.15 20.69,21.14 20.7,21.13 R9.2 20.69,21.09 v20.69,20.12 | C10.2 20.68,22.43 R10.2 | R12.2 26.38,21.09 v27.25,21.09
  Top 0.813: 24.05,6.2 C9.1 R36.1 | v23.13,5.9 v23.13,6.56
  Route15 0.305: 23.54,17.58 22.62,18.5 22.62,19.01 23.29,19.67 23.34,19.67
  Route15 0.813: v23.13,5.9 23.13,12.76 24.4,14.03 24.4,16.72 23.54,17.58 23.23,17.58 v20.69,20.12
  other vias: 27.45,26.27 29.23,26.27 29.23,23.07 28.37,26.27 28.37,23.07
  pour Route15 (no thermals): 20.69,20.17 20.75,20.12 20.69,20.12
  pour Route15 (no thermals): 27.25,26.88 27.25,21.49 26.64,20.89 23.95,20.89 22.37,19.31 21.76,19.31 21.61,19.16 21.81,19.16 22.83,18.14 22.83,18.8 23.64,19.62 27.2,19.62 28.87,21.29 28.87,22.31 29.43,22.87 29.48,22.92 29.48,26.88
  pour Top (no thermals): 27.25,26.22 27.25,23.12 27.5,22.87 29.18,22.87 29.28,22.97 29.43,23.12 29.43,23.58 29.43,26.22 29.18,26.47 27.5,26.47
  pour Top (no thermals): 23.21,5.7 23.39,5.87 24.43,5.87 24.43,8.13 23.67,8.13 23.67,6.76 23.11,6.76 23.11,5.7
(copper drawn outside any net)
  shapes: Bottom circle x8, Route15 circle x8, Route2 circle x9, Top circle x8

### Text on the board
Top: PoE | V1.1 | 11.2019 | 1
Route2: 2
Route15: 3
Bottom: 4